# Altium project PCB_AD.PrjPCB
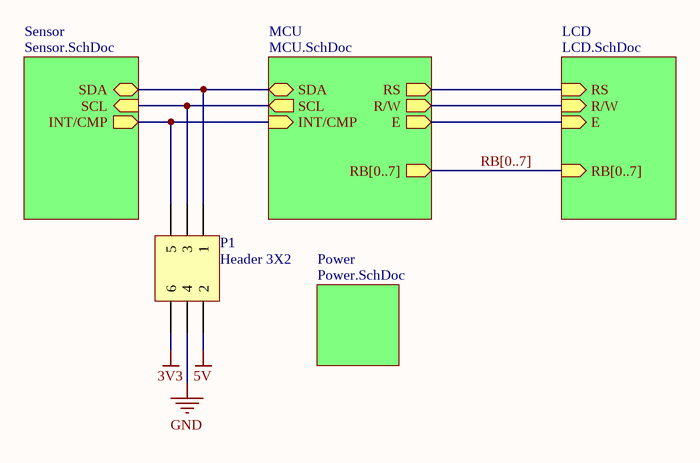
[diagram p0: PCB_AD_Top.SchDoc]
5 sheets, 22 parts. Net scope: hierarchical (ports join the sheet entries above them; power ports are global).
Board files: PCB_AD.PcbDoc, PCB_AD_M.PcbDoc, PCB_AD_M_V-CUT.PcbDoc
Sheets:
  PCB_AD_Top.SchDoc
    Sensor = Sensor.SchDoc
    MCU = MCU.SchDoc
    LCD = LCD.SchDoc
    Power = Power.SchDoc

## Sheet PCB_AD_Top.SchDoc
size A4; DocumentNumber: 1; SheetNumber: 1; SheetTotal: 5

### Parts
P1  Header 3X2  [PH2X3]

### Sub-sheets
LCD = LCD.SchDoc: RS (in), R/W (in), E (in), RB[0..7] (in)
MCU = MCU.SchDoc: SDA (bidir), SCL (out), INT/CMP (in), RS (out), R/W (out), E (out), RB[0..7] (out)
Power = Power.SchDoc: no entries
Sensor = Sensor.SchDoc: SDA (bidir), SCL (in), INT/CMP (out)

### Nets
3V3: P1.6
5V: P1.2
GND: P1.4
NetLCD1_4: sheet MCU/RS, sheet LCD/RS
NetLCD1_5: sheet MCU/R/W, sheet LCD/R/W
NetLCD1_6: sheet MCU/E, sheet LCD/E
NetP1_1: P1.1 ; sheet Sensor/SDA, sheet MCU/SDA
NetP1_3: P1.3 ; sheet Sensor/SCL, sheet MCU/SCL
NetP1_5: P1.5 ; sheet Sensor/INT/CMP, sheet MCU/INT/CMP

### Buses and harness runs
bus RB[0..7] = sheet LCD/RB[0..7] = sheet MCU/RB[0..7]

### Library data of the parts
P1 = Header 3X2: Header, 3-Pin, Dual row; LatestRevisionDate: 17-Jul-2002; LatestRevisionNote: Re-released for DXP Platform.; Publisher: Altium Limited

## Sheet Sensor.SchDoc
size A4; DocumentNumber: 5; SheetNumber: 5; SheetTotal: 5
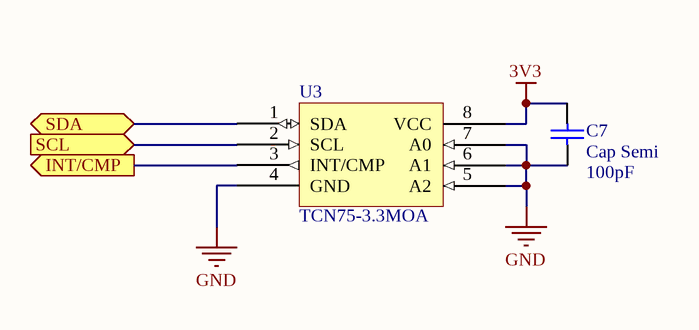
[diagram p1: Sensor.SchDoc]

### Parts
C7  Cap Semi  value 100pF  [0603_C]
U3  TCN75-3.3MOA  [SOIC-8_150mil]

### Ports
INT/CMP (out), SCL (in), SDA (bidir)

### Nets
3V3: C7.2 U3.8(VCC)
GND: C7.1 U3.4(GND) U3.5(A2) U3.6(A1) U3.7(A0)
NetP1_1: U3.1(SDA) ; port SDA
NetP1_3: U3.2(SCL) ; port SCL
NetP1_5: U3.3(INT/CMP) ; port INT/CMP

### Library data of the parts
C7 = Cap Semi: Capacitor (Semiconductor SIM Model); Published: 8-Jun-2000; LatestRevisionDate: 29-May-2009; LatestRevisionNote: IPC-7351 Footprint Added.; PackageReference: C1206; Publisher: Altium Limited; PackageDescription: Chip Capacitor
U3 = TCN75: TCN75数字温度传感器将-40°C到+125°C范围内的温度转换为数字

## Sheet MCU.SchDoc
size A4; DocumentNumber: 3; SheetNumber: 3; SheetTotal: 5
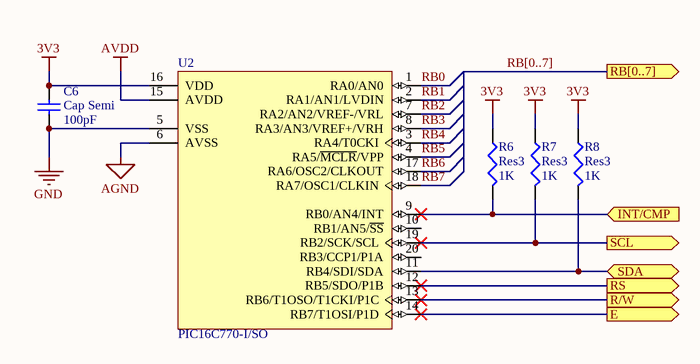
[diagram p2: MCU.SchDoc]

### Parts
C6  Cap Semi  value 100pF  [0603_C]
R6  Res3  value 1K  [0603_R]
R7  Res3  value 1K  [0603_R]
R8  Res3  value 1K  [0603_R]
U2  PIC16C770-I/SO  [SOIC-20_300mil]

### Ports
E (out), INT/CMP (in), R/W (out), RB[0..7] (out), RS (out), SCL (out), SDA (bidir)

### Nets
3V3: C6.2 R6.1 R7.1 R8.1 U2.16(VDD)
AGND: U2.6(AVSS)
AVDD: U2.15(AVDD)
GND: C6.1 U2.5(VSS)
RB0: U2.1(RA0/AN0)
RB1: U2.2(RA1/AN1/LVDIN)
RB2: U2.7(RA2/AN2/VREF-/VRL)
RB3: U2.8(RA3/AN3/VREF+/VRH)
RB4: U2.3(RA4/T0CKI)
RB5: U2.4(RA5/~{MCLR}/VPP)
RB6: U2.17(RA6/OSC2/CLKOUT)
RB7: U2.18(RA7/OSC1/CLKIN)
NetLCD1_4: U2.12(RB5/SDO/P1B) ; port RS
NetLCD1_5: U2.13(RB6/T1OSO/T1CKI/P1C) ; port R/W
NetLCD1_6: U2.14(RB7/T1OSI/P1D) ; port E
NetP1_1: R8.2 U2.11(RB4/SDI/SDA) ; port SDA
NetP1_3: R7.2 U2.19(RB2/SCK/SCL) ; port SCL
NetP1_5: R6.2 U2.9(RB0/AN4/INT) ; port INT/CMP

Not connected (* = marked no-connect by the designer): U2 10(RB1/AN5/~{SS}) 20(RB3/CCP1/P1A)

### Buses and harness runs
bus RB[0..7] = port RB[0..7]

### Library data of the parts
C6 = Cap Semi: Capacitor (Semiconductor SIM Model); Published: 8-Jun-2000; LatestRevisionDate: 29-May-2009; LatestRevisionNote: IPC-7351 Footprint Added.; PackageReference: C1206; Publisher: Altium Limited; PackageDescription: Chip Capacitor
R6-R8 = Res3: Resistor; Published: 8-Jun-2000; LatestRevisionDate: 29-May-2009; LatestRevisionNote: IPC-7351 Footprint Added.; PackageReference: J1-0603; Publisher: Altium Limited; PackageDescription: Chip Resistor
U2 = PIC16C770-I/SO: 8-Bit CMOS Microcontroller with 12-Bit A/D, 2K (x14-Bit words) EPROM, 256 Bytes RAM, 20-Pin SOIC, 4.0 to 5.5V Supply Range, Industrial Temperature; ComponentAvailability: Unknown. Contact manufacturer to determine status.; Published: 11-Oct-2004; LatestRevisionDate: 29-Jan-2009; LatestRevisionNote: Sch. layout revised. 3D Model Removed.; DatasheetVersion: revB, Feb-2002; PackageVersion: revBB, Aug-2009; PackageReference: SOIC-SO20; Publisher: Altium Limited; PackageDescription: 20-Lead Plastic Small Outline (SO) - Wide 7.50mm Body [SOIC]; Supplier 1: Digi-Key; Supplier Part Number 1: PIC16C770-I/SO-ND; Code_JEDEC: MS-013-AC; Code_IPC: SOIC127P1030-20; ComponentLink1Description: Datasheet; ComponentLink1URL: http://ww1.microchip.com/downloads/en/DeviceDoc/41120b.pdf; ComponentLink2Description: Packaging Specification; ComponentLink2URL: http://www.microchip.com/stellent/groups/techpub_sg/documents/packagingspec/en012702.pdf; ComponentLink3Description: Microchip.com Home; ComponentLink3URL: http://www.microchip.com/

## Sheet LCD.SchDoc
size A4; DocumentNumber: 2; SheetNumber: 2; SheetTotal: 5
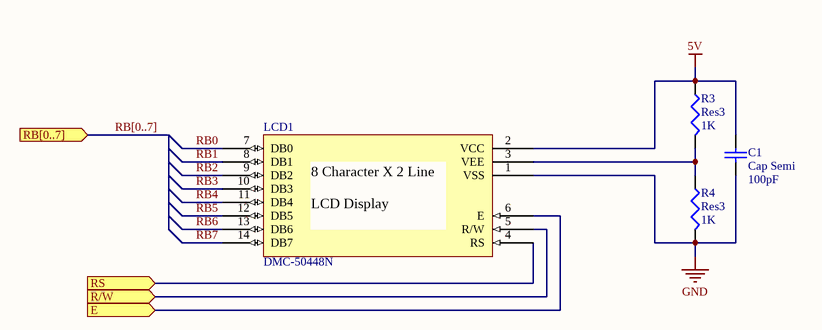
[diagram p3: LCD.SchDoc]

### Parts
C1  Cap Semi  value 100pF  [0603_C]
LCD1  DMC-50448N  [HDR1X14]
R3  Res3  value 1K  [0603_R]
R4  Res3  value 1K  [0603_R]

### Ports
E (in), R/W (in), RB[0..7] (in), RS (in)

### Nets
5V: C1.2 LCD1.2(VCC) R3.1
GND: C1.1 LCD1.1(VSS) R4.2
RB0: LCD1.7(DB0)
RB1: LCD1.8(DB1)
RB2: LCD1.9(DB2)
RB3: LCD1.10(DB3)
RB4: LCD1.11(DB4)
RB5: LCD1.12(DB5)
RB6: LCD1.13(DB6)
RB7: LCD1.14(DB7)
NetLCD1_3: LCD1.3(VEE) R3.2 R4.1
NetLCD1_4: LCD1.4(RS) ; port RS
NetLCD1_5: LCD1.5(R/W) ; port R/W
NetLCD1_6: LCD1.6(E) ; port E

### Buses and harness runs
bus RB[0..7] = port RB[0..7]

### Notes on the sheet
- (in symbol DMC-50448N) 8 Character X 2 Line / LCD Display

### Library data of the parts
C1 = Cap Semi: Capacitor (Semiconductor SIM Model); Published: 8-Jun-2000; LatestRevisionDate: 29-May-2009; LatestRevisionNote: IPC-7351 Footprint Added.; PackageReference: C1206; Publisher: Altium Limited; PackageDescription: Chip Capacitor
LCD1 = DMC-50448N: 8 Character X 2 Line / LCD Display
R3 R4 = Res3: Resistor; Published: 8-Jun-2000; LatestRevisionDate: 29-May-2009; LatestRevisionNote: IPC-7351 Footprint Added.; PackageReference: J1-0603; Publisher: Altium Limited; PackageDescription: Chip Resistor

## Sheet Power.SchDoc
size A4; DocumentNumber: 4; SheetNumber: 4; SheetTotal: 5
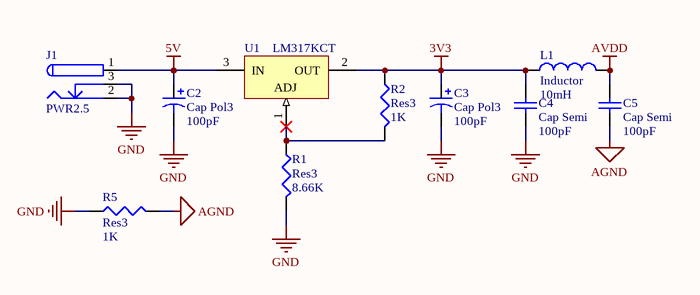
[diagram p4: Power.SchDoc]

### Parts
C2  Cap Pol3  value 100pF  [CASE-A_3216]
C3  Cap Pol3  value 100pF  [CASE-A_3216]
C4  Cap Semi  value 100pF  [0603_C]
C5  Cap Semi  value 100pF  [0603_C]
J1  PWR2.5  [DC005F]
L1  Inductor  value 10mH  [0603_L]
R1  Res3  value 8.66K  [0603_R]
R2  Res3  value 1K  [0603_R]
R5  Res3  value 1K  [0603_R]
U1  LM317KCT  [TO-220(TO-220-3)]

### Nets
3V3: C3.1 C4.2 L1.1 R2.1 U1.2(OUT)
5V: C2.1 J1.1 U1.3(IN)
AGND: C5.1 R5.2
AVDD: C5.2 L1.2
GND: C2.2 C3.2 C4.1 J1.2 J1.3 R1.2 R5.1
NetR1_1: R1.1 R2.2 U1.1(ADJ)

### Library data of the parts
C2 C3 = Cap Pol3: Polarized Capacitor (Surface Mount); Published: 8-Jun-2000; LatestRevisionDate: 29-May-2009; LatestRevisionNote: IPC-7351 Footprint Added.; PackageReference: C0805; Publisher: Altium Limited; PackageDescription: Chip Capacitor
C4 C5 = Cap Semi: Capacitor (Semiconductor SIM Model); Published: 8-Jun-2000; LatestRevisionDate: 29-May-2009; LatestRevisionNote: IPC-7351 Footprint Added.; PackageReference: C1206; Publisher: Altium Limited; PackageDescription: Chip Capacitor
J1 = PWR2.5: Low Voltage Power Supply Connector; Published: 17-Dec-2003; DatasheetDocument: 09-May-2002; Publisher: Altium Limited; ComponentLink1Description: Manufacturer Link; ComponentLink1URL: http://domino.kycon.com/internet/Products.html
L1 = Inductor: Code_IEC: 1005; Published: 8-Jun-2000; LatestRevisionDate: 29-May-2009; LatestRevisionNote: IPC-7351 Footprint Added.; PackageReference: 0402-A; Publisher: Altium Limited; PackageDescription: Chip Inductor; Code_JEITA: 0402
R1 R2 R5 = Res3: Resistor; Published: 8-Jun-2000; LatestRevisionDate: 29-May-2009; LatestRevisionNote: IPC-7351 Footprint Added.; PackageReference: J1-0603; Publisher: Altium Limited; PackageDescription: Chip Resistor
U1 = LM317KC: 3-Terminal Adjustable Regulator; Note: Pin 2 is electrically connected to tab; Published: 15-Apr-2002; DatasheetVersion: Feb-1988; PackageVersion: Sep-1995; PackageReference: KC03; Publisher: Altium Limited; PackageDescription: TO, Thru-Hole, Vertical, Heatsink Mounted; 3 In-Line Leads; Pitch 2.54 mm; ComponentLink1Description: Manufacturer Link; ComponentLink1URL: http://www.ti.com/

## Nets that join several sheets
3V3: PCB_AD_Top (P1.6), Sensor (C7.2 U3.8), MCU (5 pins), Power (5 pins)
5V: PCB_AD_Top (P1.2), LCD (C1.2 LCD1.2 R3.1), Power (C2.1 J1.1 U1.3)
AGND: MCU (U2.6), Power (C5.1 R5.2)
AVDD: MCU (U2.15), Power (C5.2 L1.2)
GND: PCB_AD_Top (P1.4), Sensor (5 pins), MCU (C6.1 U2.5), LCD (C1.1 LCD1.1 R4.2), Power (7 pins)
NetLCD1_4: MCU (U2.12), LCD (LCD1.4)
NetLCD1_5: MCU (U2.13), LCD (LCD1.5)
NetLCD1_6: MCU (U2.14), LCD (LCD1.6)
NetP1_1: PCB_AD_Top (P1.1), Sensor (U3.1), MCU (R8.2 U2.11)
NetP1_3: PCB_AD_Top (P1.3), Sensor (U3.2), MCU (R7.2 U2.19)
NetP1_5: PCB_AD_Top (P1.5), Sensor (U3.3), MCU (R6.2 U2.9)
RB0: MCU (U2.1), LCD (LCD1.7)
RB1: MCU (U2.2), LCD (LCD1.8)
RB2: MCU (U2.7), LCD (LCD1.9)
RB3: MCU (U2.8), LCD (LCD1.10)
RB4: MCU (U2.3), LCD (LCD1.11)
RB5: MCU (U2.4), LCD (LCD1.12)
RB6: MCU (U2.17), LCD (LCD1.13)
RB7: MCU (U2.18), LCD (LCD1.14)